# Altium schematic sheet SuperLED1.SchDoc
size A3; SheetNumber: 1; SheetTotal: 1
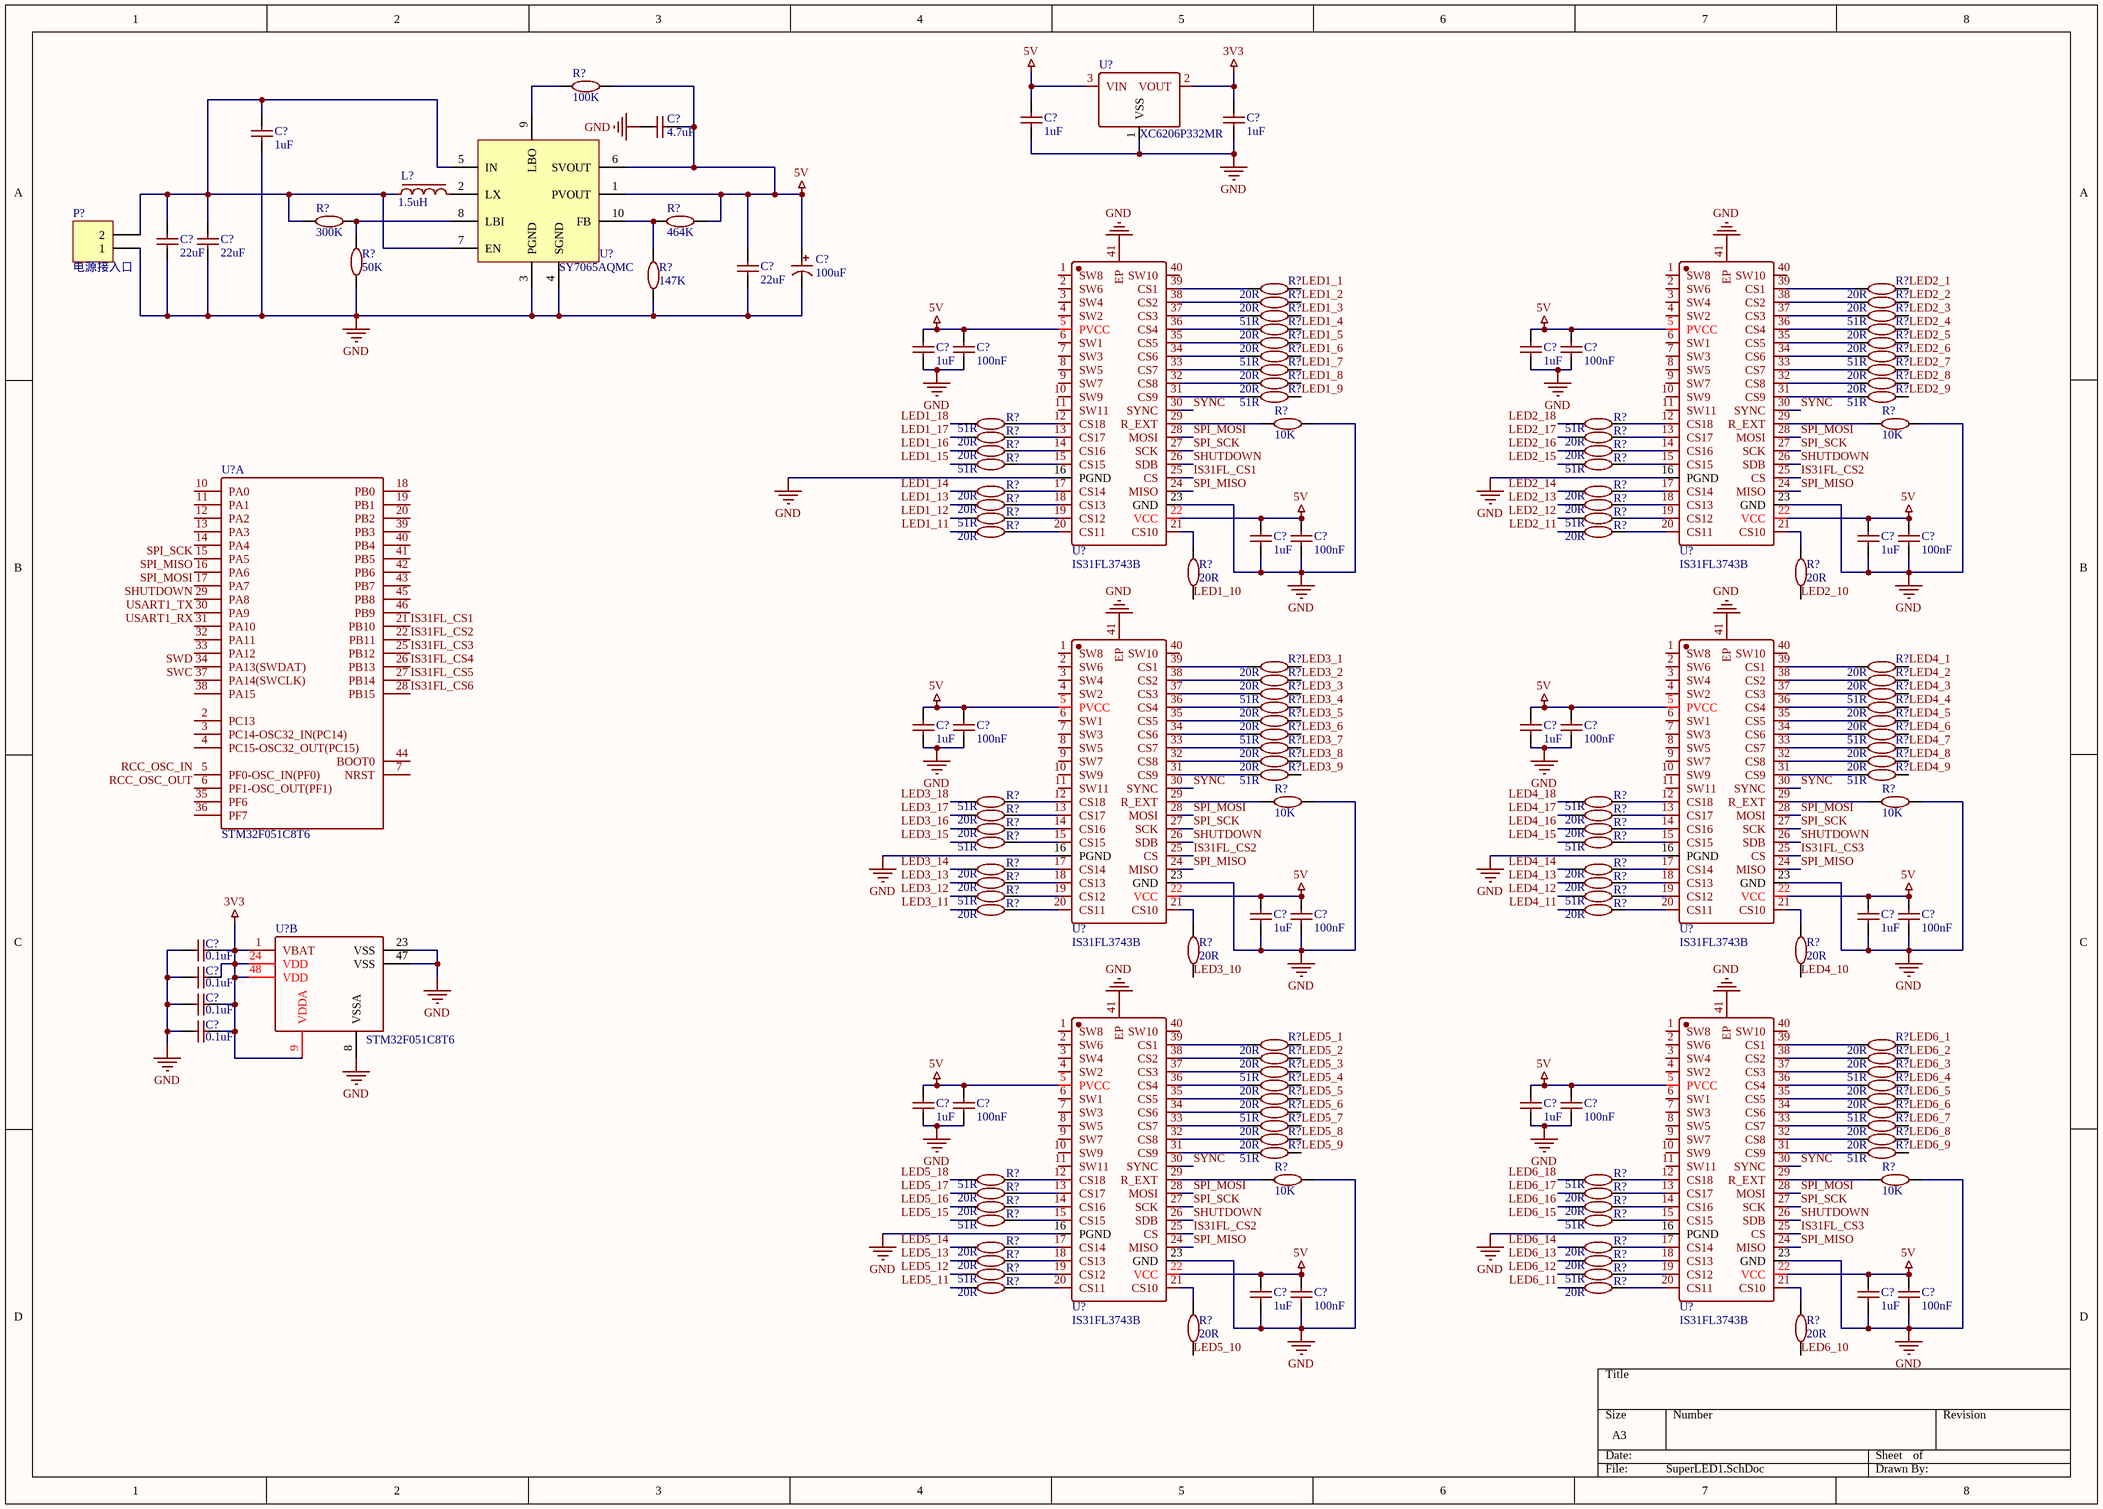
[diagram p0: SuperLED1.SchDoc]

## Parts
(Parts that share a designator on the sheet are numbered #1, #2 ... from top to bottom, then left to right.)
C?#1  1uF  [C0603]
C?#2  1uF  [C0603]
C?#3  4.7uF  [C0603]
C?#4  1uF  [C0603]
C?#5  22uF  [C0603]
C?#6  22uF  [C0603]
C?#7  22uF  [C0603]
C?#8  100uF  [CAP_6.3*11]
C?#9  1uF  [C0603]
C?#10  100nF  [C0603]
C?#11  1uF  [C0603]
C?#12  100nF  [C0603]
C?#13  1uF  [C0603]
C?#14  100nF  [C0603]
C?#15  1uF  [C0603]
C?#16  100nF  [C0603]
C?#17  1uF  [C0603]
C?#18  100nF  [C0603]
C?#19  1uF  [C0603]
C?#20  100nF  [C0603]
C?#21  0.1uF  [C0603]
C?#22  1uF  [C0603]
C?#23  100nF  [C0603]
C?#24  1uF  [C0603]
C?#25  100nF  [C0603]
C?#26  0.1uF  [C0603]
C?#27  0.1uF  [C0603]
C?#28  0.1uF  [C0603]
C?#29  1uF  [C0603]
C?#30  100nF  [C0603]
C?#31  1uF  [C0603]
C?#32  100nF  [C0603]
C?#33  1uF  [C0603]
C?#34  100nF  [C0603]
C?#35  1uF  [C0603]
C?#36  100nF  [C0603]
L?  1.5uH  [SMD_inductors]
P?  电源接入口  [2.54mm 2p]
R?#1  100K  [R0603]
R?#2  300K  [R0603]
R?#3  464K  [R0603]
R?#4  50K  [R0603]
R?#5  20R  [R0603]
R?#6  20R  [R0603]
R?#7  147K  [R0603]
R?#8  20R  [R0603]
R?#9  20R  [R0603]
R?#10  51R  [R0603]
R?#11  51R  [R0603]
R?#12  20R  [R0603]
R?#13  20R  [R0603]
R?#14  20R  [R0603]
R?#15  20R  [R0603]
R?#16  51R  [R0603]
R?#17  51R  [R0603]
R?#18  20R  [R0603]
R?#19  20R  [R0603]
R?#20  20R  [R0603]
R?#21  20R  [R0603]
R?#22  51R  [R0603]
R?#23  51R  [R0603]
R?#24  51R  [R0603]
R?#25  10K  [R0603]
R?#26  51R  [R0603]
R?#27  10K  [R0603]
R?#28  20R  [R0603]
R?#29  20R  [R0603]
R?#30  20R  [R0603]
R?#31  20R  [R0603]
R?#32  51R  [R0603]
R?#33  51R  [R0603]
R?#34  20R  [R0603]
R?#35  20R  [R0603]
R?#36  20R  [R0603]
R?#37  20R  [R0603]
R?#38  51R  [R0603]
R?#39  51R  [R0603]
R?#40  20R  [R0603]
R?#41  20R  [R0603]
R?#42  20R  [R0603]
R?#43  20R  [R0603]
R?#44  20R  [R0603]
R?#45  20R  [R0603]
R?#46  20R  [R0603]
R?#47  20R  [R0603]
R?#48  51R  [R0603]
R?#49  51R  [R0603]
R?#50  20R  [R0603]
R?#51  20R  [R0603]
R?#52  20R  [R0603]
R?#53  20R  [R0603]
R?#54  51R  [R0603]
R?#55  51R  [R0603]
R?#56  20R  [R0603]
R?#57  20R  [R0603]
R?#58  20R  [R0603]
R?#59  20R  [R0603]
R?#60  51R  [R0603]
R?#61  51R  [R0603]
R?#62  51R  [R0603]
R?#63  10K  [R0603]
R?#64  51R  [R0603]
R?#65  10K  [R0603]
R?#66  20R  [R0603]
R?#67  20R  [R0603]
R?#68  20R  [R0603]
R?#69  20R  [R0603]
R?#70  51R  [R0603]
R?#71  51R  [R0603]
R?#72  20R  [R0603]
R?#73  20R  [R0603]
R?#74  20R  [R0603]
R?#75  20R  [R0603]
R?#76  51R  [R0603]
R?#77  51R  [R0603]
R?#78  20R  [R0603]
R?#79  20R  [R0603]
R?#80  20R  [R0603]
R?#81  20R  [R0603]
R?#82  20R  [R0603]
R?#83  20R  [R0603]
R?#84  20R  [R0603]
R?#85  20R  [R0603]
R?#86  51R  [R0603]
R?#87  51R  [R0603]
R?#88  20R  [R0603]
R?#89  20R  [R0603]
R?#90  20R  [R0603]
R?#91  20R  [R0603]
R?#92  51R  [R0603]
R?#93  51R  [R0603]
R?#94  20R  [R0603]
R?#95  20R  [R0603]
R?#96  20R  [R0603]
R?#97  20R  [R0603]
R?#98  51R  [R0603]
R?#99  51R  [R0603]
R?#100  51R  [R0603]
R?#101  10K  [R0603]
R?#102  51R  [R0603]
R?#103  10K  [R0603]
R?#104  20R  [R0603]
R?#105  20R  [R0603]
R?#106  20R  [R0603]
R?#107  20R  [R0603]
R?#108  51R  [R0603]
R?#109  51R  [R0603]
R?#110  20R  [R0603]
R?#111  20R  [R0603]
R?#112  20R  [R0603]
R?#113  20R  [R0603]
R?#114  51R  [R0603]
R?#115  51R  [R0603]
R?#116  20R  [R0603]
R?#117  20R  [R0603]
R?#118  20R  [R0603]
R?#119  20R  [R0603]
U?#1  XC6206P332MR  [SOT-23]
U?#2  SY7065AQMC  [QFN-10(2x2)]
U?#3  IS31FL3743B
U?#4  IS31FL3743B
U?#5  STM32F051C8T6  (part A of 2)
U?#6  IS31FL3743B
U?#7  IS31FL3743B
U?#8  STM32F051C8T6  [LQFP-48]  (part B of 2)
U?#9  IS31FL3743B
U?#10  IS31FL3743B

## Nets
3V3: C?#2.1 C?#21.2 C?#26.2 C?#27.2 C?#28.2 U?#1.2(VOUT) U?#8.1(VBAT) U?#8.9(VDDA) U?#8.24(VDD) U?#8.48(VDD)
5V: C?#1.1 C?#3.2 C?#7.1 C?#8.1 C?#9.2 C?#10.2 C?#11.2 C?#12.2 C?#13.2 C?#14.2 C?#15.2 C?#16.2 C?#17.2 C?#18.2 C?#19.2 C?#20.2 C?#22.2 C?#23.2 C?#24.2 C?#25.2 C?#29.2 C?#30.2 C?#31.2 C?#32.2 C?#33.2 C?#34.2 C?#35.2 C?#36.2 R?#1.1 R?#3.2 U?#1.3(VIN) U?#2.1(PVOUT) U?#2.6(SVOUT) U?#3.5(PVCC) U?#3.22(VCC) U?#4.5(PVCC) U?#4.22(VCC) U?#6.5(PVCC) U?#6.22(VCC) U?#7.5(PVCC) U?#7.22(VCC) U?#9.5(PVCC) U?#9.22(VCC) U?#10.5(PVCC) U?#10.22(VCC)
GND: C?#1.2 C?#2.2 C?#3.1 C?#4.1 C?#5.2 C?#6.2 C?#7.2 C?#8.2 C?#9.1 C?#10.1 C?#11.1 C?#12.1 C?#13.1 C?#14.1 C?#15.1 C?#16.1 C?#17.1 C?#18.1 C?#19.1 C?#20.1 C?#21.1 C?#22.1 C?#23.1 C?#24.1 C?#25.1 C?#26.1 C?#27.1 C?#28.1 C?#29.1 C?#30.1 C?#31.1 C?#32.1 C?#33.1 C?#34.1 C?#35.1 C?#36.1 P?.1 R?#4.1 R?#7.1 R?#25.1 R?#27.1 R?#63.1 R?#65.1 R?#101.1 R?#103.1 U?#1.1(VSS) U?#2.3(PGND) U?#2.4(SGND) U?#3.16(PGND) U?#3.23(GND) U?#3.41(EP) U?#4.16(PGND) U?#4.23(GND) U?#4.41(EP) U?#6.16(PGND) U?#6.23(GND) U?#6.41(EP) U?#7.16(PGND) U?#7.23(GND) U?#7.41(EP) U?#8.8(VSSA) U?#8.23(VSS) U?#8.47(VSS) U?#9.16(PGND) U?#9.23(GND) U?#9.41(EP) U?#10.16(PGND) U?#10.23(GND) U?#10.41(EP)
IS31FL_CS1: U?#3.25(CS) U?#5.21(PB10)
IS31FL_CS2: U?#4.25(CS) U?#5.22(PB11) U?#6.25(CS) U?#9.25(CS)
IS31FL_CS3: U?#5.25(PB12) U?#7.25(CS) U?#10.25(CS)
IS31FL_CS4: U?#5.26(PB13)
IS31FL_CS5: U?#5.27(PB14)
IS31FL_CS6: U?#5.28(PB15)
LED1_1: R?#5.1
LED1_2: R?#8.1
LED1_3: R?#10.1
LED1_4: R?#12.1
LED1_5: R?#14.1
LED1_6: R?#16.1
LED1_7: R?#18.1
LED1_8: R?#20.1
LED1_9: R?#22.1
LED1_10: R?#42.1
LED1_11: R?#40.1
LED1_12: R?#38.1
LED1_13: R?#36.1
LED1_14: R?#34.1
LED1_15: R?#32.1
LED1_16: R?#30.1
LED1_17: R?#28.1
LED1_18: R?#24.1
LED2_1: R?#6.1
LED2_2: R?#9.1
LED2_3: R?#11.1
LED2_4: R?#13.1
LED2_5: R?#15.1
LED2_6: R?#17.1
LED2_7: R?#19.1
LED2_8: R?#21.1
LED2_9: R?#23.1
LED2_10: R?#43.1
LED2_11: R?#41.1
LED2_12: R?#39.1
LED2_13: R?#37.1
LED2_14: R?#35.1
LED2_15: R?#33.1
LED2_16: R?#31.1
LED2_17: R?#29.1
LED2_18: R?#26.1
LED3_1: R?#44.1
LED3_2: R?#46.1
LED3_3: R?#48.1
LED3_4: R?#50.1
LED3_5: R?#52.1
LED3_6: R?#54.1
LED3_7: R?#56.1
LED3_8: R?#58.1
LED3_9: R?#60.1
LED3_10: R?#80.1
LED3_11: R?#78.1
LED3_12: R?#76.1
LED3_13: R?#74.1
LED3_14: R?#72.1
LED3_15: R?#70.1
LED3_16: R?#68.1
LED3_17: R?#66.1
LED3_18: R?#62.1
LED4_1: R?#45.1
LED4_2: R?#47.1
LED4_3: R?#49.1
LED4_4: R?#51.1
LED4_5: R?#53.1
LED4_6: R?#55.1
LED4_7: R?#57.1
LED4_8: R?#59.1
LED4_9: R?#61.1
LED4_10: R?#81.1
LED4_11: R?#79.1
LED4_12: R?#77.1
LED4_13: R?#75.1
LED4_14: R?#73.1
LED4_15: R?#71.1
LED4_16: R?#69.1
LED4_17: R?#67.1
LED4_18: R?#64.1
LED5_1: R?#82.1
LED5_2: R?#84.1
LED5_3: R?#86.1
LED5_4: R?#88.1
LED5_5: R?#90.1
LED5_6: R?#92.1
LED5_7: R?#94.1
LED5_8: R?#96.1
LED5_9: R?#98.1
LED5_10: R?#118.1
LED5_11: R?#116.1
LED5_12: R?#114.1
LED5_13: R?#112.1
LED5_14: R?#110.1
LED5_15: R?#108.1
LED5_16: R?#106.1
LED5_17: R?#104.1
LED5_18: R?#100.1
LED6_1: R?#83.1
LED6_2: R?#85.1
LED6_3: R?#87.1
LED6_4: R?#89.1
LED6_5: R?#91.1
LED6_6: R?#93.1
LED6_7: R?#95.1
LED6_8: R?#97.1
LED6_9: R?#99.1
LED6_10: R?#119.1
LED6_11: R?#117.1
LED6_12: R?#115.1
LED6_13: R?#113.1
LED6_14: R?#111.1
LED6_15: R?#109.1
LED6_16: R?#107.1
LED6_17: R?#105.1
LED6_18: R?#102.1
RCC_OSC_IN: U?#5.5(PF0-OSC_IN(PF0))
RCC_OSC_OUT: U?#5.6(PF1-OSC_OUT(PF1))
SHUTDOWN: U?#3.26(SDB) U?#4.26(SDB) U?#5.29(PA8) U?#6.26(SDB) U?#7.26(SDB) U?#9.26(SDB) U?#10.26(SDB)
SPI_MISO: U?#3.24(MISO) U?#4.24(MISO) U?#5.16(PA6) U?#6.24(MISO) U?#7.24(MISO) U?#9.24(MISO) U?#10.24(MISO)
SPI_MOSI: U?#3.28(MOSI) U?#4.28(MOSI) U?#5.17(PA7) U?#6.28(MOSI) U?#7.28(MOSI) U?#9.28(MOSI) U?#10.28(MOSI)
SPI_SCK: U?#3.27(SCK) U?#4.27(SCK) U?#5.15(PA5) U?#6.27(SCK) U?#7.27(SCK) U?#9.27(SCK) U?#10.27(SCK)
SWC: U?#5.37(PA14(SWCLK))
SWD: U?#5.34(PA13(SWDAT))
SYNC: U?#3.30(SYNC) U?#4.30(SYNC) U?#6.30(SYNC) U?#7.30(SYNC) U?#9.30(SYNC) U?#10.30(SYNC)
USART1_RX: U?#5.31(PA10)
USART1_TX: U?#5.30(PA9)
NetC?#4_2: C?#4.2 C?#5.1 C?#6.1 L?.1 P?.2 R?#2.1 U?#2.5(IN) U?#2.7(EN)
NetL?_2: L?.2 U?#2.2(LX)
NetR?#1_2: R?#1.2 U?#2.9(LBO)
NetR?#2_2: R?#2.2 R?#4.2 U?#2.8(LBI)
NetR?#3_1: R?#3.1 R?#7.2 U?#2.10(FB)
NetR?#5_2: R?#5.2 U?#3.39(CS1)
NetR?#6_2: R?#6.2 U?#4.39(CS1)
NetR?#8_2: R?#8.2 U?#3.38(CS2)
NetR?#9_2: R?#9.2 U?#4.38(CS2)
NetR?#10_2: R?#10.2 U?#3.37(CS3)
NetR?#11_2: R?#11.2 U?#4.37(CS3)
NetR?#12_2: R?#12.2 U?#3.36(CS4)
NetR?#13_2: R?#13.2 U?#4.36(CS4)
NetR?#14_2: R?#14.2 U?#3.35(CS5)
NetR?#15_2: R?#15.2 U?#4.35(CS5)
NetR?#16_2: R?#16.2 U?#3.34(CS6)
NetR?#17_2: R?#17.2 U?#4.34(CS6)
NetR?#18_2: R?#18.2 U?#3.33(CS7)
NetR?#19_2: R?#19.2 U?#4.33(CS7)
NetR?#20_2: R?#20.2 U?#3.32(CS8)
NetR?#21_2: R?#21.2 U?#4.32(CS8)
NetR?#22_2: R?#22.2 U?#3.31(CS9)
NetR?#23_2: R?#23.2 U?#4.31(CS9)
NetR?#24_2: R?#24.2 U?#3.12(CS18)
NetR?#25_2: R?#25.2 U?#3.29(R_EXT)
NetR?#26_2: R?#26.2 U?#4.12(CS18)
NetR?#27_2: R?#27.2 U?#4.29(R_EXT)
NetR?#28_2: R?#28.2 U?#3.13(CS17)
NetR?#29_2: R?#29.2 U?#4.13(CS17)
NetR?#30_2: R?#30.2 U?#3.14(CS16)
NetR?#31_2: R?#31.2 U?#4.14(CS16)
NetR?#32_2: R?#32.2 U?#3.15(CS15)
NetR?#33_2: R?#33.2 U?#4.15(CS15)
NetR?#34_2: R?#34.2 U?#3.17(CS14)
NetR?#35_2: R?#35.2 U?#4.17(CS14)
NetR?#36_2: R?#36.2 U?#3.18(CS13)
NetR?#37_2: R?#37.2 U?#4.18(CS13)
NetR?#38_2: R?#38.2 U?#3.19(CS12)
NetR?#39_2: R?#39.2 U?#4.19(CS12)
NetR?#40_2: R?#40.2 U?#3.20(CS11)
NetR?#41_2: R?#41.2 U?#4.20(CS11)
NetR?#42_2: R?#42.2 U?#3.21(CS10)
NetR?#43_2: R?#43.2 U?#4.21(CS10)
NetR?#44_2: R?#44.2 U?#6.39(CS1)
NetR?#45_2: R?#45.2 U?#7.39(CS1)
NetR?#46_2: R?#46.2 U?#6.38(CS2)
NetR?#47_2: R?#47.2 U?#7.38(CS2)
NetR?#48_2: R?#48.2 U?#6.37(CS3)
NetR?#49_2: R?#49.2 U?#7.37(CS3)
NetR?#50_2: R?#50.2 U?#6.36(CS4)
NetR?#51_2: R?#51.2 U?#7.36(CS4)
NetR?#52_2: R?#52.2 U?#6.35(CS5)
NetR?#53_2: R?#53.2 U?#7.35(CS5)
NetR?#54_2: R?#54.2 U?#6.34(CS6)
NetR?#55_2: R?#55.2 U?#7.34(CS6)
NetR?#56_2: R?#56.2 U?#6.33(CS7)
NetR?#57_2: R?#57.2 U?#7.33(CS7)
NetR?#58_2: R?#58.2 U?#6.32(CS8)
NetR?#59_2: R?#59.2 U?#7.32(CS8)
NetR?#60_2: R?#60.2 U?#6.31(CS9)
NetR?#61_2: R?#61.2 U?#7.31(CS9)
NetR?#62_2: R?#62.2 U?#6.12(CS18)
NetR?#63_2: R?#63.2 U?#6.29(R_EXT)
NetR?#64_2: R?#64.2 U?#7.12(CS18)
NetR?#65_2: R?#65.2 U?#7.29(R_EXT)
NetR?#66_2: R?#66.2 U?#6.13(CS17)
NetR?#67_2: R?#67.2 U?#7.13(CS17)
NetR?#68_2: R?#68.2 U?#6.14(CS16)
NetR?#69_2: R?#69.2 U?#7.14(CS16)
NetR?#70_2: R?#70.2 U?#6.15(CS15)
NetR?#71_2: R?#71.2 U?#7.15(CS15)
NetR?#72_2: R?#72.2 U?#6.17(CS14)
NetR?#73_2: R?#73.2 U?#7.17(CS14)
NetR?#74_2: R?#74.2 U?#6.18(CS13)
NetR?#75_2: R?#75.2 U?#7.18(CS13)
NetR?#76_2: R?#76.2 U?#6.19(CS12)
NetR?#77_2: R?#77.2 U?#7.19(CS12)
NetR?#78_2: R?#78.2 U?#6.20(CS11)
NetR?#79_2: R?#79.2 U?#7.20(CS11)
NetR?#80_2: R?#80.2 U?#6.21(CS10)
NetR?#81_2: R?#81.2 U?#7.21(CS10)
NetR?#82_2: R?#82.2 U?#9.39(CS1)
NetR?#83_2: R?#83.2 U?#10.39(CS1)
NetR?#84_2: R?#84.2 U?#9.38(CS2)
NetR?#85_2: R?#85.2 U?#10.38(CS2)
NetR?#86_2: R?#86.2 U?#9.37(CS3)
NetR?#87_2: R?#87.2 U?#10.37(CS3)
NetR?#88_2: R?#88.2 U?#9.36(CS4)
NetR?#89_2: R?#89.2 U?#10.36(CS4)
NetR?#90_2: R?#90.2 U?#9.35(CS5)
NetR?#91_2: R?#91.2 U?#10.35(CS5)
NetR?#92_2: R?#92.2 U?#9.34(CS6)
NetR?#93_2: R?#93.2 U?#10.34(CS6)
NetR?#94_2: R?#94.2 U?#9.33(CS7)
NetR?#95_2: R?#95.2 U?#10.33(CS7)
NetR?#96_2: R?#96.2 U?#9.32(CS8)
NetR?#97_2: R?#97.2 U?#10.32(CS8)
NetR?#98_2: R?#98.2 U?#9.31(CS9)
NetR?#99_2: R?#99.2 U?#10.31(CS9)
NetR?#100_2: R?#100.2 U?#9.12(CS18)
NetR?#101_2: R?#101.2 U?#9.29(R_EXT)
NetR?#102_2: R?#102.2 U?#10.12(CS18)
NetR?#103_2: R?#103.2 U?#10.29(R_EXT)
NetR?#104_2: R?#104.2 U?#9.13(CS17)
NetR?#105_2: R?#105.2 U?#10.13(CS17)
NetR?#106_2: R?#106.2 U?#9.14(CS16)
NetR?#107_2: R?#107.2 U?#10.14(CS16)
NetR?#108_2: R?#108.2 U?#9.15(CS15)
NetR?#109_2: R?#109.2 U?#10.15(CS15)
NetR?#110_2: R?#110.2 U?#9.17(CS14)
NetR?#111_2: R?#111.2 U?#10.17(CS14)
NetR?#112_2: R?#112.2 U?#9.18(CS13)
NetR?#113_2: R?#113.2 U?#10.18(CS13)
NetR?#114_2: R?#114.2 U?#9.19(CS12)
NetR?#115_2: R?#115.2 U?#10.19(CS12)
NetR?#116_2: R?#116.2 U?#9.20(CS11)
NetR?#117_2: R?#117.2 U?#10.20(CS11)
NetR?#118_2: R?#118.2 U?#9.21(CS10)
NetR?#119_2: R?#119.2 U?#10.21(CS10)

Not connected (* = marked no-connect by the designer): U?#3 1(SW8) 2(SW6) 3(SW4) 4(SW2) 6(SW1) 7(SW3) 8(SW5) 9(SW7) 10(SW9) 11(SW11) 40(SW10); U?#4 1(SW8) 2(SW6) 3(SW4) 4(SW2) 6(SW1) 7(SW3) 8(SW5) 9(SW7) 10(SW9) 11(SW11) 40(SW10); U?#5 2(PC13) 3(PC14-OSC32_IN(PC14)) 4(PC15-OSC32_OUT(PC15)) 7(NRST) 10(PA0) 11(PA1) 12(PA2) 13(PA3) 14(PA4) 18(PB0) 19(PB1) 20(PB2) 32(PA11) 33(PA12) 35(PF6) 36(PF7) 38(PA15) 39(PB3) 40(PB4) 41(PB5) 42(PB6) 43(PB7) 44(BOOT0) 45(PB8) 46(PB9); U?#6 1(SW8) 2(SW6) 3(SW4) 4(SW2) 6(SW1) 7(SW3) 8(SW5) 9(SW7) 10(SW9) 11(SW11) 40(SW10); U?#7 1(SW8) 2(SW6) 3(SW4) 4(SW2) 6(SW1) 7(SW3) 8(SW5) 9(SW7) 10(SW9) 11(SW11) 40(SW10); U?#9 1(SW8) 2(SW6) 3(SW4) 4(SW2) 6(SW1) 7(SW3) 8(SW5) 9(SW7) 10(SW9) 11(SW11) 40(SW10); U?#10 1(SW8) 2(SW6) 3(SW4) 4(SW2) 6(SW1) 7(SW3) 8(SW5) 9(SW7) 10(SW9) 11(SW11) 40(SW10)

## Library data of the parts
C?#1-C?#7 C?#9-C?#36 = cap
C?#8 = cap2
L? = Inductance
P? = Header 2H: Header, 2-Pin, Right Angle; LatestRevisionDate: 17-Jul-2002; LatestRevisionNote: Re-released for DXP Platform.; Publisher: Altium Limited
R?#1-R?#119 = res
U?#3 U?#4 U?#6 U?#7 U?#9 U?#10 = IS31FL3743B: IS31FL3743B/40-UQFN/LM